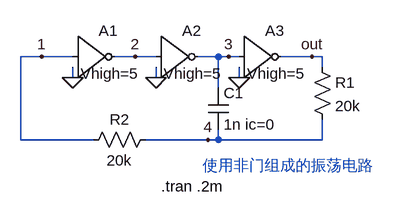
[diagram p0: schematic Draft2.asc]
Draft2.asc, the LTspice schematic file:
Version 4
SHEET 1 880 680
WIRE 304 192 272 192
WIRE 352 192 304 192
WIRE 448 192 416 192
WIRE 480 192 448 192
WIRE 576 192 544 192
WIRE 592 192 576 192
WIRE 608 192 592 192
WIRE 720 192 672 192
WIRE 736 192 720 192
WIRE 736 208 736 192
WIRE 352 224 352 208
WIRE 480 224 480 208
WIRE 608 224 608 208
WIRE 576 240 576 192
WIRE 272 320 272 192
WIRE 384 320 272 320
WIRE 560 320 464 320
WIRE 576 320 576 304
WIRE 576 320 560 320
WIRE 736 320 736 288
WIRE 736 320 576 320
FLAG 352 224 0
FLAG 480 224 0
FLAG 608 224 0
FLAG 448 192 2
FLAG 592 192 3
FLAG 560 320 4
FLAG 720 192 out
FLAG 304 192 1
SYMBOL Digital/inv 352 128 R0
WINDOW 3 12 90 Left 2
SYMATTR InstName A1
SYMATTR Value Vhigh=5
SYMBOL Digital/inv 480 128 R0
WINDOW 3 12 90 Left 2
SYMATTR InstName A2
SYMATTR Value Vhigh=5
SYMBOL Digital/inv 608 128 R0
WINDOW 3 12 90 Left 2
SYMATTR InstName A3
SYMATTR Value Vhigh=5
SYMBOL Cap 560 240 R0
SYMATTR InstName C1
SYMATTR Value 1n ic=0
SYMBOL Res 720 192 R0
SYMATTR InstName R1
SYMATTR Value 20k
SYMBOL Res 480 304 R90
WINDOW 0 0 56 VBottom 2
WINDOW 3 32 56 VTop 2
SYMATTR InstName R2
SYMATTR Value 20k
TEXT 488 392 Left 2 !.tran .2m
TEXT 552 360 Left 2 ;使用非门组成的振荡电路

The netlist it stands for:
* Draft2.asc
A1 1 0 0 0 0 2 0 0 BUF Vhigh=5
A2 2 0 0 0 0 3 0 0 BUF Vhigh=5
A3 3 0 0 0 0 out 0 0 BUF Vhigh=5
C1 3 4 1n ic=0
R1 out 4 20k
R2 4 1 20k
.tran .2m
* 使用非门组成的振荡电路
.backanno
.end